# EAGLE design compass (EAGLE 8.7.0)
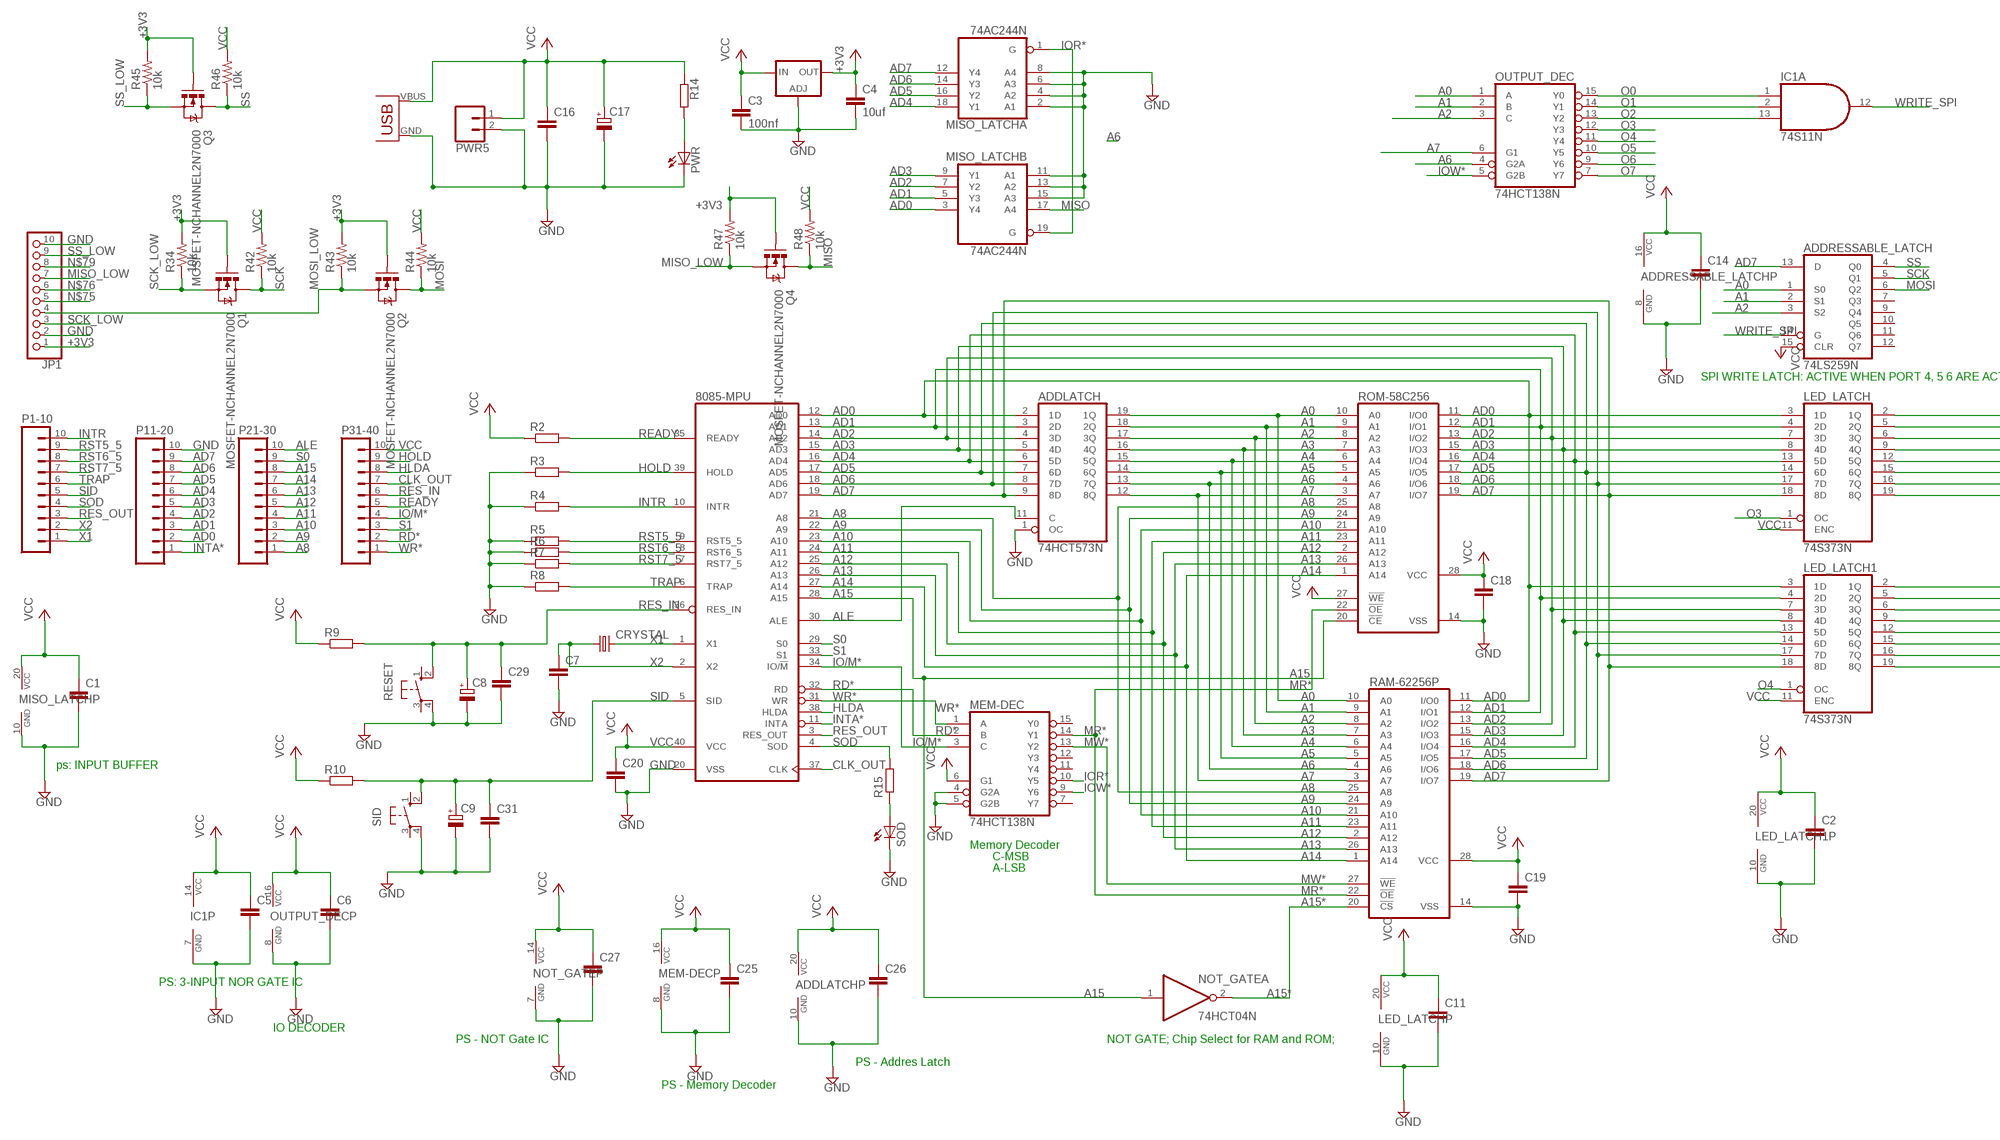
[diagram p0: schematic, sheet 1, part 1 of 2]
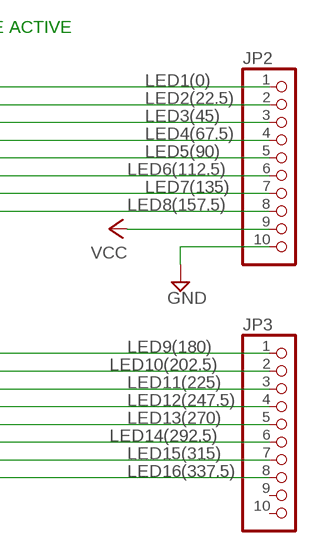
[diagram p1: schematic, sheet 1, part 2 of 2]

## Parts
8085-MPU  8085  [DIL40]
ADDLATCH  74HCT573N  [DIL20]
ADDRESSABLE_LATCH  74LS259N  [DIL16]
C1  C-EU025-025X050  [C025-025X050]
C2  C-EU025-025X050  [C025-025X050]
C3  100nf  C-EU025-025X050  [C025-025X050]
C4  10uf  C-EU025-025X050  [C025-025X050]
C5  C-EU025-025X050  [C025-025X050]
C6  C-EU025-025X050  [C025-025X050]
C7  C-EU025-025X050  [C025-025X050]
C8  CPOL-EUE2.5-6  [E2,5-6]
C9  CPOL-EUE2.5-6  [E2,5-6]
C11  C-EU025-025X050  [C025-025X050]
C14  C-EU025-025X050  [C025-025X050]
C16  C-EU025-025X050  [C025-025X050]
C17  CPOL-EUE2.5-6  [E2,5-6]
C18  C-EU025-025X050  [C025-025X050]
C19  C-EU025-025X050  [C025-025X050]
C20  C-EU025-025X050  [C025-025X050]
C25  C-EU025-025X050  [C025-025X050]
C26  C-EU025-025X050  [C025-025X050]
C27  C-EU025-025X050  [C025-025X050]
C29  C-EU025-025X050  [C025-025X050]
C31  C-EU025-025X050  [C025-025X050]
CRYSTAL  CRYSTALHC49US  [HC49US]
IC1  74S11N  [DIL14]
IC10  LD117AS33TR  [SOT223]
JP1  PINHD-1X10  [1X10]
JP2  PINHD-1X10  [1X10]
JP3  PINHD-1X10  [1X10]
LED_LATCH  74S373N  [DIL20]
LED_LATCH1  74S373N  [DIL20]
MEM-DEC  74HCT138N  [DIL16]
MISO_LATCH  74AC244N  [DIL20]
NOT_GATE  74HCT04N  [DIL14]
OUTPUT_DEC  74HCT138N  [DIL16]
P1-10  M10  [10P]
P11-20  M10  [10P]
P21-30  M10  [10P]
P31-40  M10  [10P]
PWR  LED5MM  [LED5MM]
PWR5  M02  [02P]
Q1  MOSFET-NCHANNEL2N7000  [TO-92]
Q2  MOSFET-NCHANNEL2N7000  [TO-92]
Q3  MOSFET-NCHANNEL2N7000  [TO-92]
Q4  MOSFET-NCHANNEL2N7000  [TO-92]
R2  R-EU_0204/7  [0204/7]
R3  R-EU_0204/7  [0204/7]
R4  R-EU_0204/7  [0204/7]
R5  R-EU_0204/7  [0204/7]
R6  R-EU_0204/7  [0204/7]
R7  R-EU_0204/7  [0204/7]
R8  R-EU_0204/7  [0204/7]
R9  R-EU_0204/7  [0204/7]
R10  R-EU_0204/7  [0204/7]
R14  R-EU_0204/7  [0204/7]
R15  R-EU_0204/7  [0204/7]
R34  10k  R-US_0204/7  [0204/7]
R42  10k  R-US_0204/7  [0204/7]
R43  10k  R-US_0204/7  [0204/7]
R44  10k  R-US_0204/7  [0204/7]
R45  10k  R-US_0204/7  [0204/7]
R46  10k  R-US_0204/7  [0204/7]
R47  10k  R-US_0204/7  [0204/7]
R48  10k  R-US_0204/7  [0204/7]
RAM-62256P  62256P  [DIL28-6]
RESET  10-XX  [B3F-10XX]
ROM-58C256  58C256P  [DIL28-6]
SID  10-XX  [B3F-10XX]
SOD  LED5MM  [LED5MM]
USB  USB(POWER)  [USB(POWER)]

## Nets
+3V3: C4.1 IC10.4(OUT) JP1.1 Q1.2(G) Q2.2(G) Q3.2(G) Q4.2(G) R34.2 R43.2 R45.2 R47.2
A0: ADDLATCH.19(1Q) ADDRESSABLE_LATCH.1(S0) OUTPUT_DEC.1(A) RAM-62256P.10(A0) ROM-58C256.10(A0)
A1: ADDLATCH.18(2Q) ADDRESSABLE_LATCH.2(S1) OUTPUT_DEC.2(B) RAM-62256P.9(A1) ROM-58C256.9(A1)
A2: ADDLATCH.17(3Q) ADDRESSABLE_LATCH.3(S2) OUTPUT_DEC.3(C) RAM-62256P.8(A2) ROM-58C256.8(A2)
A3: ADDLATCH.16(4Q) RAM-62256P.7(A3) ROM-58C256.7(A3)
A4: ADDLATCH.15(5Q) RAM-62256P.6(A4) ROM-58C256.6(A4)
A5: ADDLATCH.14(6Q) RAM-62256P.5(A5) ROM-58C256.5(A5)
A6: ADDLATCH.13(7Q) OUTPUT_DEC.4(G2A) RAM-62256P.4(A6) ROM-58C256.4(A6)
A7: ADDLATCH.12(8Q) OUTPUT_DEC.6(G1) RAM-62256P.3(A7) ROM-58C256.3(A7)
A8: 8085-MPU.21(A8) P21-30.1 RAM-62256P.25(A8) ROM-58C256.25(A8)
A9: 8085-MPU.22(A9) P21-30.2 RAM-62256P.24(A9) ROM-58C256.24(A9)
A10: 8085-MPU.23(A10) P21-30.3 RAM-62256P.21(A10) ROM-58C256.21(A10)
A11: 8085-MPU.24(A11) P21-30.4 RAM-62256P.23(A11) ROM-58C256.23(A11)
A12: 8085-MPU.25(A12) P21-30.5 RAM-62256P.2(A12) ROM-58C256.2(A12)
A13: 8085-MPU.26(A13) P21-30.6 RAM-62256P.26(A13) ROM-58C256.26(A13)
A14: 8085-MPU.27(A14) P21-30.7 RAM-62256P.1(A14) ROM-58C256.1(A14)
A15: 8085-MPU.28(A15) NOT_GATE.1(A:I) P21-30.8 ROM-58C256.20(!CE)
A15*: NOT_GATE.2(A:O) RAM-62256P.20(!CS)
AD0: 8085-MPU.12(AD0) ADDLATCH.2(1D) LED_LATCH1.3(1D) LED_LATCH.3(1D) MISO_LATCH.3(B:Y4) P11-20.2 RAM-62256P.11(I/O0) ROM-58C256.11(I/O0)
AD1: 8085-MPU.13(AD1) ADDLATCH.3(2D) LED_LATCH1.4(2D) LED_LATCH.4(2D) MISO_LATCH.5(B:Y3) P11-20.3 RAM-62256P.12(I/O1) ROM-58C256.12(I/O1)
AD2: 8085-MPU.14(AD2) ADDLATCH.4(3D) LED_LATCH1.7(3D) LED_LATCH.7(3D) MISO_LATCH.7(B:Y2) P11-20.4 RAM-62256P.13(I/O2) ROM-58C256.13(I/O2)
AD3: 8085-MPU.15(AD3) ADDLATCH.5(4D) LED_LATCH1.8(4D) LED_LATCH.8(4D) MISO_LATCH.9(B:Y1) P11-20.5 RAM-62256P.15(I/O3) ROM-58C256.15(I/O3)
AD4: 8085-MPU.16(AD4) ADDLATCH.6(5D) LED_LATCH1.13(5D) LED_LATCH.13(5D) MISO_LATCH.18(A:Y1) P11-20.6 RAM-62256P.16(I/O4) ROM-58C256.16(I/O4)
AD5: 8085-MPU.17(AD5) ADDLATCH.7(6D) LED_LATCH1.14(6D) LED_LATCH.14(6D) MISO_LATCH.16(A:Y2) P11-20.7 RAM-62256P.17(I/O5) ROM-58C256.17(I/O5)
AD6: 8085-MPU.18(AD6) ADDLATCH.8(7D) LED_LATCH1.17(7D) LED_LATCH.17(7D) MISO_LATCH.14(A:Y3) P11-20.8 RAM-62256P.18(I/O6) ROM-58C256.18(I/O6)
AD7: 8085-MPU.19(AD7) ADDLATCH.9(8D) ADDRESSABLE_LATCH.13(D) LED_LATCH1.18(8D) LED_LATCH.18(8D) MISO_LATCH.12(A:Y4) P11-20.9 RAM-62256P.19(I/O7) ROM-58C256.19(I/O7)
ALE: 8085-MPU.30(ALE) ADDLATCH.11(C) P21-30.10
CLK_OUT: 8085-MPU.37(CLK) P31-40.7
GND [power1]: 8085-MPU.20(VSS) ADDLATCH.1(OC) ADDLATCH.10(GND) ADDRESSABLE_LATCH.8(GND) C1.2 C2.2 C3.2 C4.2 C5.2 C6.2 C7.2 C8.- C9.- C11.2 C14.2 C16.2 C17.- C18.2 C19.2 C20.2 C25.2 C26.2 C27.2 C29.2 C31.2 IC1.7(P:GND) IC10.1(ADJ) JP1.2 JP1.10 JP2.10 LED_LATCH1.10(GND) LED_LATCH.10(GND) MEM-DEC.4(G2A) MEM-DEC.5(G2B) MEM-DEC.8(GND) MISO_LATCH.2(A:A1) MISO_LATCH.4(A:A2) MISO_LATCH.6(A:A3) MISO_LATCH.8(A:A4) MISO_LATCH.10(P:GND) MISO_LATCH.11(B:A1) MISO_LATCH.13(B:A2) MISO_LATCH.15(B:A3) NOT_GATE.7(P:GND) OUTPUT_DEC.8(GND) P11-20.10 PWR5.2 PWR.K(C) R3.1 R4.1 R5.1 R6.1 R7.1 R8.1 RAM-62256P.14(VSS) RESET.4(P1) ROM-58C256.14(VSS) SID.4(P1) SOD.K(C) USB.GND
HLDA: 8085-MPU.38(HLDA) P31-40.8
HOLD: 8085-MPU.39(HOLD) P31-40.9 R3.2
INTA*: 8085-MPU.11(INTA) P11-20.1
INTR: 8085-MPU.10(INTR) P1-10.10 R4.2
IO/M*: 8085-MPU.34(IO/!M) MEM-DEC.3(C) P31-40.4
IOR*: MEM-DEC.10(Y5) MISO_LATCH.1(A:G) MISO_LATCH.19(B:G)
IOW*: MEM-DEC.9(Y6) OUTPUT_DEC.5(G2B)
LED1(0): JP2.1 LED_LATCH.2(1Q)
LED2(22.5): JP2.2 LED_LATCH.5(2Q)
LED3(45): JP2.3 LED_LATCH.6(3Q)
LED4(67.5): JP2.4 LED_LATCH.9(4Q)
LED5(90): JP2.5 LED_LATCH.12(5Q)
LED6(112.5): JP2.6 LED_LATCH.15(6Q)
LED7(135): JP2.7 LED_LATCH.16(7Q)
LED8(157.5): JP2.8 LED_LATCH.19(8Q)
LED9(180): JP3.1 LED_LATCH1.2(1Q)
LED10(202.5): JP3.2 LED_LATCH1.5(2Q)
LED11(225): JP3.3 LED_LATCH1.6(3Q)
LED12(247.5): JP3.4 LED_LATCH1.9(4Q)
LED13(270): JP3.5 LED_LATCH1.12(5Q)
LED14(292.5): JP3.6 LED_LATCH1.15(6Q)
LED15(315): JP3.7 LED_LATCH1.16(7Q)
LED16(337.5): JP3.8 LED_LATCH1.19(8Q)
MISO: MISO_LATCH.17(B:A4) Q4.3(D) R48.1
MISO_LOW: JP1.7 Q4.1(S) R47.1
MOSI: ADDRESSABLE_LATCH.6(Q2) Q2.3(D) R44.1
MOSI_LOW: JP1.4 Q2.1(S) R43.1
MR*: MEM-DEC.14(Y1) RAM-62256P.22(!OE) ROM-58C256.22(!OE)
MW*: MEM-DEC.13(Y2) RAM-62256P.27(!WE)
N$25: R15.1 SOD.A
N$39: PWR.A R14.2
N$75: JP1.5
N$76: JP1.6
N$79: JP1.8
O0: IC1.1(A:I0) OUTPUT_DEC.15(Y0)
O1: IC1.2(A:I1) OUTPUT_DEC.14(Y1)
O2: IC1.13(A:I2) OUTPUT_DEC.13(Y2)
O3: LED_LATCH.1(OC) OUTPUT_DEC.12(Y3)
O4: LED_LATCH1.1(OC) OUTPUT_DEC.11(Y4)
O5: OUTPUT_DEC.10(Y5)
O6: OUTPUT_DEC.9(Y6)
O7: OUTPUT_DEC.7(Y7)
RD*: 8085-MPU.32(RD) MEM-DEC.2(B) P31-40.2
READY: 8085-MPU.35(READY) P31-40.5 R2.2
RES_IN: 8085-MPU.36(RES_IN) C8.+ C29.1 P31-40.6 R9.2 RESET.2(S1)
RES_OUT: 8085-MPU.3(RES_OUT) P1-10.3
RST5_5: 8085-MPU.9(RST5_5) P1-10.9 R5.2
RST6_5: 8085-MPU.8(RST6_5) P1-10.8 R6.2
RST7_5: 8085-MPU.7(RST7_5) P1-10.7 R7.2
S0: 8085-MPU.29(S0) P21-30.9
S1: 8085-MPU.33(S1) P31-40.3
SCK: ADDRESSABLE_LATCH.5(Q1) Q1.3(D) R42.1
SCK_LOW: JP1.3 Q1.1(S) R34.1
SID: 8085-MPU.5(SID) C9.+ C31.1 P1-10.5 R10.2 SID.2(S1)
SOD: 8085-MPU.4(SOD) P1-10.4 R15.2
SS: ADDRESSABLE_LATCH.4(Q0) Q3.3(D) R46.1
SS_LOW: JP1.9 Q3.1(S) R45.1
TRAP: 8085-MPU.6(TRAP) P1-10.6 R8.2
VCC [power1]: 8085-MPU.40(VCC) ADDLATCH.20(VCC) ADDRESSABLE_LATCH.15(CLR) ADDRESSABLE_LATCH.16(VCC) C1.1 C2.1 C3.1 C5.1 C6.1 C11.1 C14.1 C16.1 C17.+ C18.1 C19.1 C20.1 C25.1 C26.1 C27.1 IC1.14(P:VCC) IC10.3(IN) JP2.9 LED_LATCH1.11(ENC) LED_LATCH1.20(VCC) LED_LATCH.11(ENC) LED_LATCH.20(VCC) MEM-DEC.6(G1) MEM-DEC.16(VCC) MISO_LATCH.20(P:VCC) NOT_GATE.14(P:VCC) OUTPUT_DEC.16(VCC) P31-40.10 PWR5.1 R2.1 R9.1 R10.1 R14.1 R42.2 R44.2 R46.2 R48.2 RAM-62256P.28(VCC) ROM-58C256.27(!WE) ROM-58C256.28(VCC) USB.VBUS(VCC)
WR*: 8085-MPU.31(WR) MEM-DEC.1(A) P31-40.1
WRITE_SPI: ADDRESSABLE_LATCH.14(G) IC1.12(A:O)
X1: 8085-MPU.1(X1) CRYSTAL.2 P1-10.1
X2: 8085-MPU.2(X2) C7.1 CRYSTAL.1 P1-10.2
Unconnected: ADDRESSABLE_LATCH.7(Q3) ADDRESSABLE_LATCH.9(Q4) ADDRESSABLE_LATCH.10(Q5) ADDRESSABLE_LATCH.11(Q6) ADDRESSABLE_LATCH.12(Q7) IC1.3(B:I0) IC1.4(B:I1) IC1.5(B:I2) IC1.6(B:O) IC1.8(C:O) IC1.9(C:I0) IC1.10(C:I1) IC1.11(C:I2) JP3.9 JP3.10 MEM-DEC.7(Y7) MEM-DEC.11(Y4) MEM-DEC.12(Y3) MEM-DEC.15(Y0) NOT_GATE.3(B:I) NOT_GATE.4(B:O) NOT_GATE.5(C:I) NOT_GATE.6(C:O) NOT_GATE.8(D:O) NOT_GATE.9(D:I) NOT_GATE.10(E:O) NOT_GATE.11(E:I) NOT_GATE.12(F:O) NOT_GATE.13(F:I) RESET.1(S) RESET.3(P) SID.1(S) SID.3(P)

## Notes on the sheet
- SPI WRITE LATCH: ACTIVE WHEN PORT 4, 5 6 ARE ACTIVE
- ps: INPUT BUFFER
- Memory Decoder
- C-MSB
- A-LSB
- PS: 3-INPUT NOR GATE IC
- IO DECODER
- PS - NOT Gate IC | NOT GATE; Chip Select for RAM and ROM;
- PS - Addres Latch
- PS - Memory Decoder

## Library data of the parts
8085-MPU = micro-intel:8085: MICROCOMPUTER/PERIPHERAL DEVICE; OC_FARNELL: unknown; OC_NEWARK: unknown
ADDLATCH = 74xx-eu:74*573: 8-bit D latch BUS DRIVER
ADDRESSABLE_LATCH = 74xx-us:74*259: 8-bit addressable LATCH
C1-C6 C11 C14 C16 C18-C20 C25-C27 = resistor:C-EU: CAPACITOR, European symbol
C7 C29 C31 = rcl:C-EU: CAPACITOR, European symbol
C8 C9 C17 = rcl:CPOL-EU: POLARIZED CAPACITOR, European symbol
CRYSTAL = CEDT_JANUARY_2015_v5:CRYSTAL: Crystals Various standard crystals. Proven footprints. Spark Fun Electronics SKU : COM-00534
IC1 = 74xx-us:74*11: Triple 3-input AND gate
IC10 = v-reg:LD117A?*: Low drop fixed and adjustable positive voltage regulators 1 A Source: http://www.st.com/stonline/products/literature/ds/7194/ld1117axx.pdf
JP1-JP3 = pinhead:PINHD-1X10: PIN HEADER
LED_LATCH LED_LATCH1 = 74xx-us:74*373: Octal D type transparent LATCH, edge triggered
MEM-DEC OUTPUT_DEC = 74xx-eu:74*138: 3-line to 8-line DECODER/DEMULTIPLEXER
MISO_LATCH = 74xx-eu:74*244: Octal BUFFER and LINE DRIVER, 3-state
NOT_GATE = 74xx-eu:74*04: Hex INVERTER
P1-10 P11-20 P21-30 P31-40 = con-amp-quick:M10: AMP QUICK CONNECTOR; OC_FARNELL: unknown; OC_NEWARK: unknown
PWR SOD = CEDTv79:LED
PWR5 = CEDT_JANUARY_2015_v5:M02: AMP QUICK CONNECTOR
Q1-Q4 = SparkFun-DiscreteSemi:MOSFET-NCHANNEL: Common NMOSFET Parts MFG P/N Store ID Prod ID FDD8780 TRANS-09984 SI7820DN TRANS-11055 FDS6630A IC-08089 2N7002PW TRANS-11151 FQP30N06L COM-10213 TRANS-10060 BSS123LT1G TRANS-08345 BSS138 TRANS-00830 BS170 2N7000
R2-R8 R14 R15 = rcl:R-EU_: RESISTOR, European symbol
R9 R10 = resistor:R-EU_: RESISTOR, European symbol
R34 R42-R48 = rcl:R-US_: RESISTOR, American symbol
RAM-62256P = memory-hitachi:62256P: MEMORY; OC_FARNELL: unknown; OC_NEWARK: unknown
RESET SID = switch-omron:10-XX: OMRON SWITCH; MPN: B3F-1000; OC_FARNELL: 176432; OC_NEWARK: 36M3542
ROM-58C256 = memory-hitachi:58C256P: MEMORY; MPN: HN58C256AP85E; OC_FARNELL: 1496447; OC_NEWARK: 61M6616
USB = CEDT_JANUARY_2015_v5:USB(POWER)

## Net classes
0 default: width 0.356 mm, clearance 0.2 mm
1 power1: width 0.61 mm, clearance 0.2 mm
2 powermotor: width 0.762 mm, clearance 0.2 mm

## Board
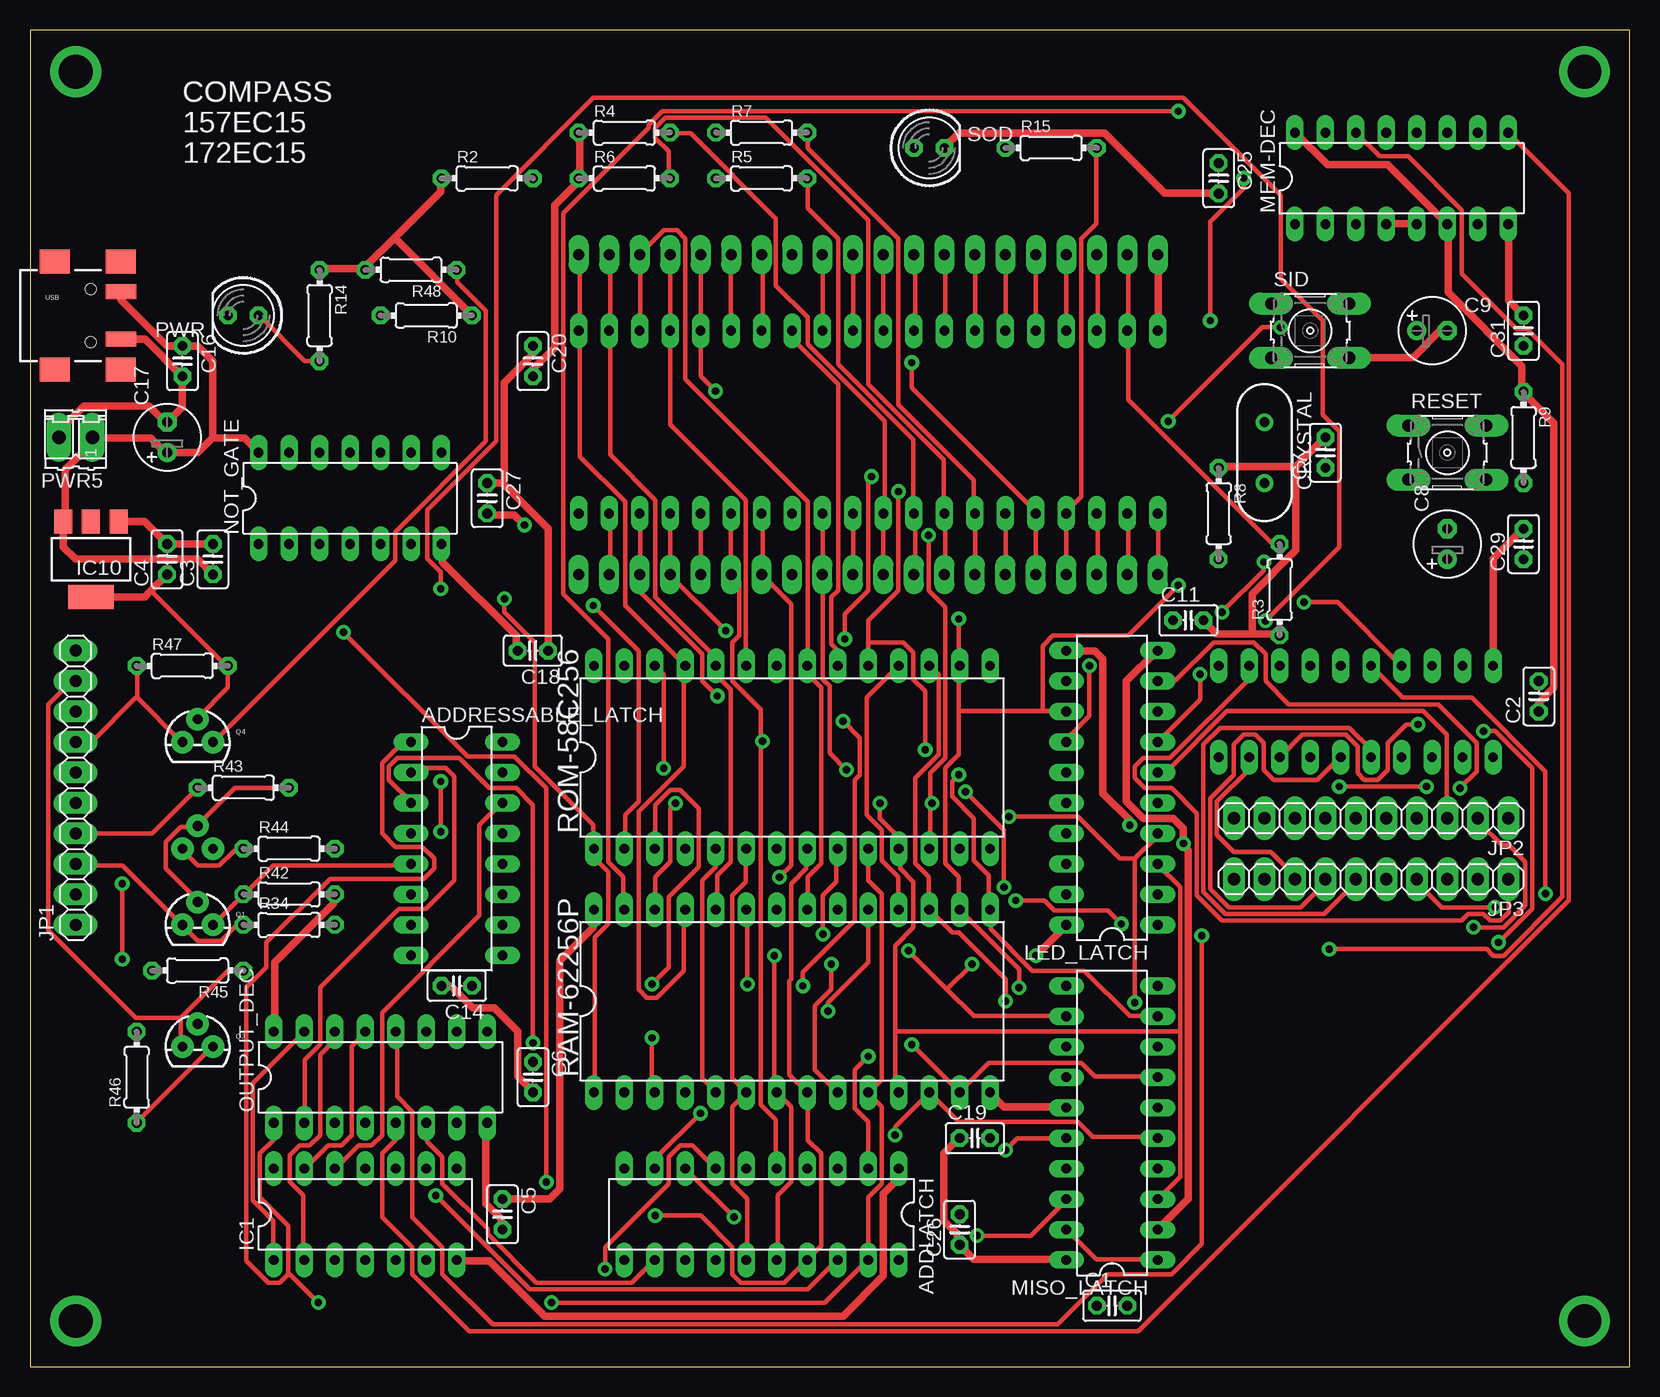
[diagram p2: board, top side]
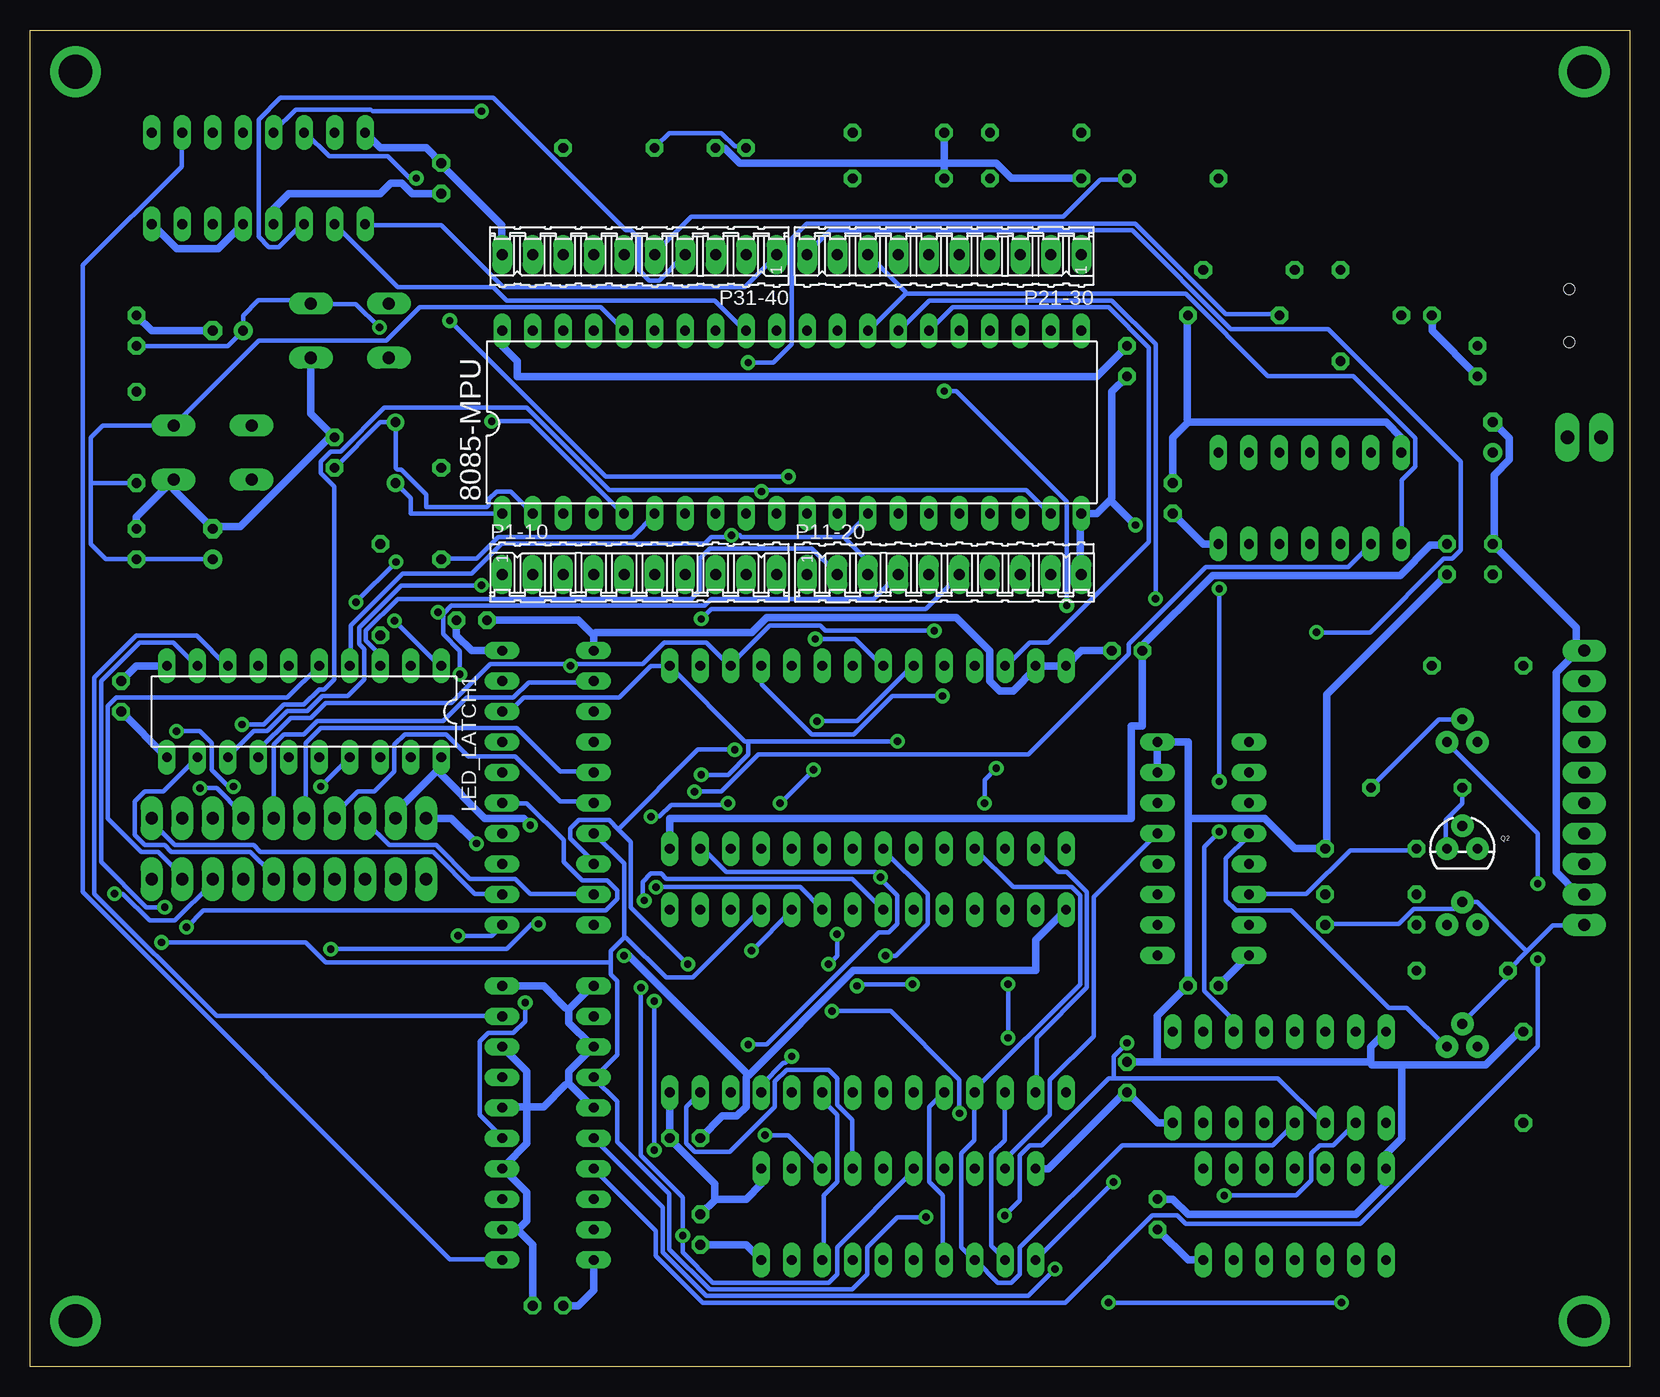
[diagram p3: board, bottom side, seen from below]

Size 133.33 x 111.43 mm. Coordinates in mm from the lower left corner, seen from the top.
Outline: 0,0 133.33,0 133.33,111.43 0,111.43 0,0
Copper layers (1*16): Top 0.035mm / dielectric 1.5mm / Bottom 0.035mm
Design rules "default *": minimum track width 10mil, minimum drill 24mil, track to track 8mil, track to pad 8mil, pad to pad 8mil, via to via 8mil, smd to smd 8mil, copper to edge 40mil, drill to drill 8mil, minimum pad ring 12mil, minimum via ring 12mil, stop-mask expansion 4mil, vias tented up to drill 0mil, thermal gap 10mil

### Footprints (pad centres in the part's own frame; a part is rotated, then mirrored left to right if it is on the bottom)
DIL40 = drill 0.813 long: 1 -24.13,-7.62; 2 -21.59,-7.62; 3 -19.05,-7.62; 4 -16.51,-7.62; 5 -13.97,-7.62; 6 -11.43,-7.62; 7 -8.89,-7.62; 8 -6.35,-7.62; 9 -3.81,-7.62; 10 -1.27,-7.62; 11 1.27,-7.62; 12 3.81,-7.62; 13 6.35,-7.62; 14 8.89,-7.62; 15 11.43,-7.62; 16 13.97,-7.62; 17 16.51,-7.62; 18 19.05,-7.62; 19 21.59,-7.62; 20 24.13,-7.62; 21 24.13,7.62; 22 21.59,7.62; 23 19.05,7.62; 24 16.51,7.62; 25 13.97,7.62; 26 11.43,7.62; 27 8.89,7.62; 28 6.35,7.62; 29 3.81,7.62; 30 1.27,7.62; 31 -1.27,7.62; 32 -3.81,7.62; 33 -6.35,7.62; 34 -8.89,7.62; 35 -11.43,7.62; 36 -13.97,7.62; 37 -16.51,7.62; 38 -19.05,7.62; 39 -21.59,7.62; 40 -24.13,7.62
DIL20 = drill 0.813 long: 1 -11.43,-3.81; 2 -8.89,-3.81; 3 -6.35,-3.81; 4 -3.81,-3.81; 5 -1.27,-3.81; 6 1.27,-3.81; 7 3.81,-3.81; 8 6.35,-3.81; 9 8.89,-3.81; 10 11.43,-3.81; 11 11.43,3.81; 12 8.89,3.81; 13 6.35,3.81; 14 3.81,3.81; 15 1.27,3.81; 16 -1.27,3.81; 17 -3.81,3.81; 18 -6.35,3.81; 19 -8.89,3.81; 20 -11.43,3.81
DIL16 = drill 0.813 long: 1 -8.89,-3.81; 2 -6.35,-3.81; 3 -3.81,-3.81; 4 -1.27,-3.81; 5 1.27,-3.81; 6 3.81,-3.81; 7 6.35,-3.81; 8 8.89,-3.81; 9 8.89,3.81; 10 6.35,3.81; 11 3.81,3.81; 12 1.27,3.81; 13 -1.27,3.81; 14 -3.81,3.81; 15 -6.35,3.81; 16 -8.89,3.81
C025-025X050 = drill 0.813 octagon: 1 -1.27,0; 2 1.27,0
E2,5-6 = drill 0.813 pad 1.6: + -1.27,0 | drill 0.813 pad 1.6 octagon: - 1.27,0
HC49US = drill 0.813: 1 -2.54,0; 2 2.54,0
DIL14 = drill 0.813 long: 1 -7.62,-3.81; 2 -5.08,-3.81; 3 -2.54,-3.81; 4 0,-3.81; 5 2.54,-3.81; 6 5.08,-3.81; 7 7.62,-3.81; 8 7.62,3.81; 9 5.08,3.81; 10 2.54,3.81; 11 0,3.81; 12 -2.54,3.81; 13 -5.08,3.81; 14 -7.62,3.81
SOT223 = smd 1.5 x 2: 1 -2.3,-3.15; 2 0,-3.15; 3 2.3,-3.15 | smd 3.8 x 2: 4 0,3.15
1X10 = drill 1.016 long: 1 -11.43,0; 2 -8.89,0; 3 -6.35,0; 4 -3.81,0; 5 -1.27,0; 6 1.27,0; 7 3.81,0; 8 6.35,0; 9 8.89,0; 10 11.43,0
10P = drill 0.914 long: 1 -11.43,0; 2 -8.89,0; 3 -6.35,0; 4 -3.81,0; 5 -1.27,0; 6 1.27,0; 7 3.81,0; 8 6.35,0; 9 8.89,0; 10 11.43,0
LED5MM = drill 0.813 octagon: A -1.27,0; K 1.27,0
02P = drill 1.143 long: 1 -1.397,0; 2 1.397,0
TO-92 = drill 0.813 pad 1.88: 1 -1.27,0; 2 0,1.905; 3 1.27,0
0204/7 = drill 0.813 octagon: 1 -3.81,0; 2 3.81,0
DIL28-6 = drill 0.813 long: 1 -16.51,-7.62; 2 -13.97,-7.62; 3 -11.43,-7.62; 4 -8.89,-7.62; 5 -6.35,-7.62; 6 -3.81,-7.62; 7 -1.27,-7.62; 8 1.27,-7.62; 9 3.81,-7.62; 10 6.35,-7.62; 11 8.89,-7.62; 12 11.43,-7.62; 13 13.97,-7.62; 14 16.51,-7.62; 15 16.51,7.62; 16 13.97,7.62; 17 11.43,7.62; 18 8.89,7.62; 19 6.35,7.62; 20 3.81,7.62; 21 1.27,7.62; 22 -1.27,7.62; 23 -3.81,7.62; 24 -6.35,7.62; 25 -8.89,7.62; 26 -11.43,7.62; 27 -13.97,7.62; 28 -16.51,7.62
B3F-10XX = drill 1.016 long: 1 -3.251,2.261; 2 3.251,2.261; 3 -3.251,-2.261; 4 3.251,-2.261
USB(POWER) = smd 2.54 x 1.27: GND 2.5,-1.981; VBUS 2.5,1.981 | smd 2.5 x 2: GND@1 -3,-4.5; GND@2 -3,4.5; GND@3 2.5,4.5; GND@4 2.5,-4.5 | hole 0.9: 0,2.2; 0,-2.2

### Placement (x,y rotation side)
8085-MPU  69.85,78.74 0 bottom
ADDLATCH  60.96,12.7 180 top
ADDRESSABLE_LATCH  35.56,43.18 270 top
C1  90.17,5.08 0 top
C2  125.73,55.88 90 top
C3  15.24,67.31 90 top
C4  11.43,67.31 90 top
C5  39.37,12.7 270 top
C6  41.91,24.13 270 top
C7  107.95,76.2 90 top
C8  118.11,68.58 90 top
C9  116.84,86.36 0 top
C11  96.52,62.23 0 top
C14  35.56,31.75 180 top
C16  12.7,83.82 270 top
C17  11.43,77.47 90 top
C18  41.91,59.69 180 top
C19  78.74,19.05 0 top
C20  41.91,83.82 270 top
C25  99.06,99.06 270 top
C26  77.47,11.43 90 top
C27  38.1,72.39 270 top
C29  124.46,68.58 90 top
C31  124.46,86.36 90 top
CRYSTAL  102.87,76.2 270 top
IC1  27.94,12.7 0 top
IC10  5.08,67.31 180 top
JP1  3.81,48.26 90 top
JP2  111.76,45.72 180 top
JP3  111.76,40.64 180 top
LED_LATCH  90.17,48.26 90 top
LED_LATCH1  110.49,54.61 180 bottom
MEM-DEC  114.3,99.06 0 top
MISO_LATCH  90.17,20.32 90 top
NOT_GATE  26.67,72.39 0 top
OUTPUT_DEC  29.21,24.13 0 top
P1-10  82.55,66.04 0 bottom
P11-20  57.15,66.04 0 bottom
P21-30  57.15,92.71 180 bottom
P31-40  82.55,92.71 180 bottom
PWR  17.78,87.63 180 top
PWR5  3.81,77.47 180 top
Q1  13.97,36.83 0 top
Q2  13.97,43.18 0 bottom
Q3  13.97,26.67 0 top
Q4  13.97,52.07 0 top
R2  38.1,99.06 0 top
R3  104.14,64.77 90 top
R4  49.53,102.87 0 top
R5  60.96,99.06 0 top
R6  49.53,99.06 0 top
R7  60.96,102.87 0 top
R8  99.06,71.12 270 top
R9  124.46,77.47 270 top
R10  33.02,87.63 180 top
R14  24.13,87.63 270 top
R15  85.09,101.6 0 top
R34  21.59,36.83 0 top
R42  21.59,39.37 0 top
R43  17.78,48.26 0 top
R44  21.59,43.18 0 top
R45  13.97,33.02 180 top
R46  8.89,24.13 90 top
R47  12.7,58.42 0 top
R48  31.75,91.44 180 top
RAM-62256P  63.5,30.48 0 top
RESET  118.11,76.2 0 top
ROM-58C256  63.5,50.8 0 top
SID  106.68,86.36 0 top
SOD  74.93,101.6 0 top
USB  5.08,87.63 0 top

### Tracks (layer width: path | path; a pad name or v marks a point on that pad's centre or on a via)
+3V3
  Top 0.356: Q4.2 13.97,54.09 16.48,56.6 16.48,58.42 R47.2 16.34,58.42 10.08,64.69 | R43.2 21.51,48.22 17.04,48.22 13.97,45.15 Q2.2 13.83,45.01 12.57,45.01 11.32,43.75 11.32,41.52 13.97,38.86 Q1.2
  Top 0.61: C4.1 10.08,64.69 9.55,64.16 IC10.4
  Bottom 0.356: Q3.2 13.97,28.66 10.2,32.44 10.2,32.99 R45.2 10.06,33.13 8.59,34.6 | 8.59,34.6 6.43,36.77 3.91,36.77 JP1.1 | R34.2 25.29,36.91 19.28,36.91 18.02,38.16 14.53,38.16 13.97,38.72 Q1.2 13.83,38.72 12.71,38.72 8.59,34.6 | Q4.2 13.97,53.95 15.93,53.95 21.51,48.36 R43.2
A0  (via drill 0.61)
  Top 0.356: ROM-58C256.10 69.85,40.54 70.97,39.42 70.97,23.91 69.99,22.94 RAM-62256P.10 69.85,22.8 70.97,21.68 70.97,15.25 69.85,14.14 ADDLATCH.19 69.71,8.83 66.22,5.33 v43.45,5.33 | 21.51,7.71 21.51,11.76 19.14,14.14 19.14,17.77 20.26,18.88 20.26,20.28 OUTPUT_DEC.1 | 21.51,7.71 20.82,7.01 19.84,7.01 18.02,8.83 18.02,31.6 19.7,33.27 19.7,35.37 25.01,40.68 32.83,40.68 33.67,41.52 33.67,42.35 32.69,43.33 30.45,43.33 29.34,44.45 29.34,50.32 31.01,51.99 31.71,51.99 ADDRESSABLE_LATCH.1 | v24.03,5.33 21.65,7.71 21.51,7.71
  Bottom 0.356: v24.03,5.33 v43.45,5.33
A1  (via drill 0.61)
  Top 0.356: v66.08,36.07 66.08,39.28 67.2,40.4 67.2,43.05 ROM-58C256.9 | v66.78,33.55 66.78,31.46 65.38,30.06 65.38,24.75 67.2,22.94 RAM-62256P.9 | OUTPUT_DEC.2 22.91,20.42 22.91,25.59 24.17,26.85 24.17,31.6 30.73,38.16 32.97,38.16 35.34,40.54 35.34,49.2 34.65,49.9 32.13,49.9 31.85,49.62 ADDRESSABLE_LATCH.2 | v33.81,14.27 41.63,6.45 64.82,6.45 67.2,8.83 ADDLATCH.18
  Bottom 0.356: ADDLATCH.18 67.2,8.97 67.2,14.27 66.08,15.39 66.08,20.98 67.2,22.1 67.2,22.8 RAM-62256P.9 | v66.08,36.07 66.08,34.25 v66.78,33.55 | v33.81,14.27 27.8,14.27 26.54,15.53 26.54,17.77 25.84,18.47 24.73,18.47 22.91,20.28 OUTPUT_DEC.2
A2  (via drill 0.61)
  Top 0.356: v52.11,12.6 55.88,12.6 58.53,9.94 58.53,7.71 59.23,7.01 62.87,7.01 64.68,8.83 ADDLATCH.17 64.82,8.97 65.94,10.08 65.94,17.77 64.82,18.88 64.82,22.8 RAM-62256P.8 64.68,22.94 63.28,24.33 63.28,32.16 63.42,32.3 63.42,40.26 64.68,41.52 64.68,43.05 ROM-58C256.8 | v41.91,26.99 41.91,46.82 40.51,48.22 38.28,48.22 35.76,50.74 30.59,50.74 29.9,50.04 29.9,48.92 31.71,47.1 ADDRESSABLE_LATCH.3
  Bottom 0.356: 43.03,24.05 43.45,24.05 49.03,18.47 50.01,18.47 50.85,17.63 50.85,13.86 v52.11,12.6 | 43.03,24.05 29.34,24.05 25.7,20.42 25.43,20.42 OUTPUT_DEC.3 | v41.91,26.99 43.03,25.87 43.03,24.05
A3  (via drill 0.61)
  Top 0.356: ADDLATCH.16 62.31,8.97 62.31,14.27 63.42,15.39 63.42,21.68 62.31,22.8 RAM-62256P.7 62.17,22.94 62.03,23.08 v62.03,34.25
  Bottom 0.356: v62.03,34.25 61.19,34.25 58.53,36.91 58.53,39.42 62.17,43.05 ROM-58C256.7
A4
  Top 0.356: ADDLATCH.15 59.79,8.97 59.79,14 58.53,15.25 58.53,21.68 59.65,22.8 RAM-62256P.6 59.65,22.94 58.53,24.05 58.53,39.28 59.65,40.4 59.65,43.05 ROM-58C256.6
A5
  Top 0.356: ROM-58C256.5 57.14,43.05 57.14,41.66 56.02,40.54 56.02,24.05 57.14,22.94 RAM-62256P.5
  Bottom 0.356: ADDLATCH.14 57.28,8.97 57.28,14.27 58.4,15.39 58.4,21.68 57.28,22.8 RAM-62256P.5
A6
  Bottom 0.356: OUTPUT_DEC.4 27.94,20.28 29.76,18.47 42.33,18.47 50.85,9.94 50.85,7.71 51.55,7.01 52.67,7.01 54.48,8.83 ADDLATCH.13 54.76,8.97 55.74,9.94 55.74,17.77 54.62,18.88 54.62,22.8 RAM-62256P.4 54.76,22.94 45.82,31.88 45.82,39.28 46.52,39.98 51.41,39.98 ROM-58C256.4
A7  (via drill 0.61)
  Top 0.356: OUTPUT_DEC.6 33.11,20.28 33.11,18.74 34.37,17.49 34.37,15.25 38.14,11.48 38.14,11.06 42.19,7.01 50.15,7.01 51.97,8.83 ADDLATCH.12 | v51.83,31.88 53.23,33.27 53.23,39.14 55.74,41.66 55.74,46.55 54.2,48.08 53.37,48.08 52.11,46.82 52.11,43.19 ROM-58C256.3 | v51.83,27.41 51.83,23.08 51.97,22.94 RAM-62256P.3
  Bottom 0.356: RAM-62256P.3 52.11,22.8 52.11,18.88 53.23,17.77 53.23,10.08 52.11,8.97 ADDLATCH.12 | v51.83,27.41 v51.83,31.88
A8
  Top 0.356: P21-30.1 45.82,92.65 45.82,86.36 8085-MPU.21 45.82,86.22 45.82,75.88 49.59,72.11 49.59,63.45 54.48,58.56 ROM-58C256.25 54.48,58.42 54.48,50.04 50.71,46.27 50.71,31.46 51.41,30.76 52.25,30.76 54.48,32.99 54.48,38.02 RAM-62256P.25
A9
  Top 0.356: P21-30.2 48.34,92.65 48.34,86.36 8085-MPU.22 48.34,86.22 48.34,76.02 52.11,72.25 52.11,64.15 57.14,59.12 57.14,58.56 ROM-58C256.24 57.28,58.42 57.28,57.58 58.4,56.46 58.4,42.07 57.28,40.96 57.28,38.16 RAM-62256P.24
A10
  Top 0.356: 8085-MPU.23 50.85,86.36 50.85,92.65 P21-30.3 50.85,92.79 52.81,94.74 53.92,94.74 54.62,94.04 54.62,82.31 64.82,72.11 64.82,58.56 ROM-58C256.21 64.82,58.42 64.82,57.72 65.94,56.6 65.94,41.94 64.82,40.82 64.82,38.16 RAM-62256P.21
A11  (via drill 0.61)
  Top 0.356: P21-30.4 53.37,92.65 53.37,86.36 8085-MPU.24 53.37,86.22 53.37,78.54 59.65,72.25 59.65,58.42 ROM-58C256.23 | v59.79,31.88 59.79,38.02 RAM-62256P.23 | v64.4,31.74 64.4,32.86 68.73,37.19 68.73,48.92 69.15,49.34 69.15,52.41 v67.75,53.81
  Bottom 0.356: v59.79,31.88 64.26,31.88 v64.4,31.74 | v67.75,53.81 64.4,53.81 59.79,58.42 ROM-58C256.23
A12  (via drill 0.61)
  Top 0.356: P21-30.5 8085-MPU.25 55.88,82.59 v57.14,81.33 | v46.94,63.45 50.71,59.68 50.71,47.1 49.59,45.99 49.59,43.19 ROM-58C256.2
  Bottom 0.356: RAM-62256P.2 49.45,22.94 49.45,27.41 45.26,31.6 45.26,39.56 46.94,41.24 47.64,41.24 49.45,43.05 ROM-58C256.2 | v57.14,81.33 56.16,81.33 46.94,72.11 v46.94,63.45
A13  (via drill 0.61)
  Top 0.356: 8085-MPU.26 58.4,86.36 58.4,92.65 P21-30.6 | v53.78,46.96 53.37,46.55 53.37,42.07 52.11,40.82 52.11,38.16 RAM-62256P.26 | v52.81,49.9 52.81,57.72 52.11,58.42 ROM-58C256.26
  Bottom 0.356: v53.78,46.96 53.78,48.92 v52.81,49.9 | 8085-MPU.26 58.4,86.36 56.44,88.32 43.45,88.32 40.09,84.96 40.09,68.76 48.48,60.38 50.01,60.38 51.97,58.42 ROM-58C256.26
A14  (via drill 0.61)
  Top 0.356: 8085-MPU.27 61.05,86.36 61.05,92.65 P21-30.7 | RAM-62256P.1 47.08,22.94 47.08,35.79 48.2,36.91 48.2,41.24 47.08,42.35 47.08,43.05 ROM-58C256.1 46.94,43.33 46.94,45.15 42.05,50.04 42.05,60.38 39.53,62.89 v39.53,64.01
  Bottom 0.356: v39.53,64.01 39.53,85.24 43.17,88.88 58.4,88.88 60.91,86.36 8085-MPU.27
A15
  Top 0.356: ROM-58C256.20 67.2,58.42 67.2,59.82 66.78,60.24 66.78,64.15 67.33,64.71 67.33,81.89 63.56,85.66 63.56,86.36 8085-MPU.28
  Bottom 0.356: 60.35,89.43 37.02,89.43 30.18,82.59 23.05,82.59 17.88,77.42 17.88,75.04 19,73.93 19,68.62 NOT_GATE.1 | 60.35,89.43 63.42,86.36 8085-MPU.28 | P21-30.8 63.42,92.65 60.35,89.57 60.35,89.43
A15*  (via drill 0.61)
  Top 0.356: v81.17,39.98 81.17,44.73 v77.95,47.94
  Bottom 0.356: v81.17,39.98 69.15,39.98 67.33,38.16 RAM-62256P.20 | v77.95,47.94 75.72,47.94 72.64,51.02 50.15,51.02 41.77,59.4 41.77,60.24 35.34,66.66 23.47,66.66 21.65,68.48 NOT_GATE.2
AD0  (via drill 0.61)
  Top 0.356: 8085-MPU.12 66.08,70.99 66.08,66.1 P11-20.2 66.08,65.96 66.08,57.3 66.64,56.74 66.64,51.16 v68.03,49.76 | 95.83,27.96 95.83,39.98 94.02,41.8 LED_LATCH.3 | 95.83,27.96 95.83,15.81 94.02,14 MISO_LATCH.3 | ADDLATCH.2 69.85,20.42 68.73,21.54 68.73,24.75 v69.85,25.87 | 72.08,27.96 72.08,23.22 72.36,22.94 RAM-62256P.11 | 72.08,27.96 72.08,35.09 73.62,36.63 73.62,40.4 72.5,41.52 72.5,43.05 ROM-58C256.11 72.36,43.33 72.36,44.17 70.83,45.71 v70.83,46.96 | 72.08,27.96 95.83,27.96
  Bottom 0.356: LED_LATCH1.3 104.22,58.42 104.22,59.4 105.33,60.52 105.33,61.35 102.68,64.01 78.23,64.01 77.53,64.71 77.53,67.36 76.69,68.2 68.17,68.2 66.08,66.1 P11-20.2 | v69.85,25.87 70.41,25.31 70.55,25.31 72.36,23.49 72.36,22.94 RAM-62256P.11 | v70.83,46.96 v68.03,49.76
AD1  (via drill 0.61)
  Top 0.356: v72.08,19.3 72.08,20 74.88,22.8 RAM-62256P.12 75.02,22.8 77.39,20.42 87.31,20.42 88.57,19.16 93.88,19.16 MISO_LATCH.5 | 92.06,42.35 93.88,44.17 93.88,44.45 LED_LATCH.4 | v92.06,30.34 92.06,42.35 | 75.02,46.96 75.02,49.48 76.28,50.74 76.28,63.31 74.88,64.71 v74.88,69.32 | 75.02,46.96 75.02,43.19 ROM-58C256.12 | 92.06,42.35 90.81,42.35 87.31,45.85 v81.58,45.85 | v75.16,46.96 75.02,46.96
  Bottom 0.356: v72.08,19.3 70.13,19.3 67.33,16.51 ADDLATCH.3 | v92.06,30.34 92.06,28.8 93.04,27.83 95.14,27.83 95.83,27.13 95.83,20.98 94.02,19.16 MISO_LATCH.5 | 65.38,69.18 74.04,69.18 74.18,69.32 v74.88,69.32 74.88,69.18 76.56,69.18 77.11,68.62 94.02,68.62 96.53,66.1 102.26,66.1 106.59,61.77 106.59,58.42 LED_LATCH1.4 | 65.38,69.18 63.56,70.99 8085-MPU.13 | P11-20.3 63.56,66.1 63.56,67.22 65.38,69.04 65.38,69.18 | v81.58,45.85 80.89,45.85 79.91,46.82 75.3,46.82 v75.16,46.96
AD2  (via drill 0.61)
  Top 0.356: MISO_LATCH.7 93.88,24.19 88.71,24.19 87.59,25.31 79.91,25.31 77.53,22.94 RAM-62256P.13 v73.48,26.85 | 8085-MPU.14 61.05,70.99 61.05,66.1 P11-20.4 61.05,65.96 63.42,63.59 63.42,41.8 v62.45,40.82 | v97.51,57.72 97.51,55.63 94.02,52.13 LED_LATCH.7 | v106.17,63.73 108.97,63.73 114.28,58.42 LED_LATCH1.7 | v102.82,67.08 102.82,66.38 v99.33,62.89
  Bottom 0.356: RAM-62256P.13 78.65,21.68 78.65,18.61 77.95,17.91 75.02,17.91 71.25,21.68 71.25,23.77 70.27,24.75 66.78,24.75 66.08,24.05 66.08,21.82 64.82,20.56 64.82,16.51 ADDLATCH.4 | ROM-58C256.13 77.39,43.05 77.11,43.05 75.3,41.24 62.87,41.24 v62.45,40.82 62.45,40.68 61.05,39.28 61.05,36.91 61.75,36.21 62.59,36.21 71.94,26.85 v73.48,26.85 | v97.51,57.72 97.51,59.68 98.91,61.07 98.91,62.61 | 98.91,62.61 98.91,62.75 98.21,63.45 77.11,63.45 76.56,64.01 63.01,64.01 61.05,65.96 P11-20.4 | v102.82,67.08 v106.17,63.73 | v99.33,62.89 99.05,62.61 98.91,62.61
AD3  (via drill 0.61)
  Top 0.356: MISO_LATCH.9 93.88,29.22 91.64,29.22 87.87,32.99 83.54,32.99 80.05,36.49 80.05,38.02 RAM-62256P.15 79.91,38.16 79.91,40.96 78.65,42.21 78.65,45.71 76.83,47.52 76.83,48.78 v77.39,49.34 | 60.91,52.13 60.91,54.79 58.53,57.16 58.53,60.38 59.09,60.94 59.09,65.41 58.53,65.96 P11-20.5 58.4,66.1 58.4,70.99 8085-MPU.15 | 60.91,52.13 60.91,21.82 62.17,20.56 62.17,16.51 ADDLATCH.5 | v61.05,52.13 60.91,52.13
  Bottom 0.356: LED_LATCH1.8 116.93,58.42 119.44,60.94 124.47,60.94 127.97,57.44 127.97,39.42 117.77,29.22 94.02,29.22 MISO_LATCH.9 | LED_LATCH.8 93.88,54.65 93.32,54.65 92.2,55.77 84.24,55.77 81.58,58.42 ROM-58C256.15 79.91,58.28 73.76,52.13 73.48,52.13 | v61.05,52.13 73.48,52.13 | v77.39,49.34 75.16,49.34 73.48,51.02 73.48,52.13
AD4  (via drill 0.61)
  Top 0.356: v78.93,10.92 83.4,10.92 86.33,13.86 MISO_LATCH.18 | P11-20.6 8085-MPU.16 | 77.39,54.65 77.39,58.42 ROM-58C256.16 77.39,58.56 v77.39,62.33 | 77.39,54.65 77.39,51.02 76.28,49.9 76.28,41.94 77.39,40.82 77.39,38.16 RAM-62256P.16 77.53,38.02 82.42,33.13 v82.42,31.6 | 77.39,54.65 84.38,54.65 | 84.38,54.65 86.33,54.65 LED_LATCH.13 | v95.69,65.13 91.5,60.94 85.22,60.94 84.38,60.1 84.38,54.65
  Bottom 0.356: ADDLATCH.6 59.79,16.51 59.79,16.23 66.08,9.94 66.08,7.71 66.78,7.01 76.42,7.01 78.93,9.53 v78.93,10.92 78.93,14.14 82.42,17.63 v82.42,31.6 | v95.69,65.13 102.4,65.13 105.89,61.63 105.89,60.24 105.47,59.82 105.47,57.3 106.87,55.91 108.97,55.91 110.22,54.65 111.9,54.65 113.58,52.97 114.69,52.97 116.79,50.88 LED_LATCH1.13 | v77.39,62.33 76.56,63.17 58.67,63.17 55.88,65.96 P11-20.6
AD5  (via drill 0.61)
  Top 0.356: v47.92,8.13 47.92,9.94 53.23,15.25 53.23,17.49 54.2,18.47 55.18,18.47 57.14,16.51 ADDLATCH.7 | 8085-MPU.17 53.37,70.99 53.37,66.1 P11-20.7 53.37,65.96 v57.98,61.35 | ROM-58C256.17 75.02,58.42 75.72,57.72 75.72,51.02 73.76,49.06 73.76,41.94 74.88,40.82 74.88,38.16 RAM-62256P.17 75.02,38.02 76.83,36.21 77.39,36.21 81.31,32.3 v81.31,30.48 | v88.29,58.42 88.29,54.23 86.47,52.41 86.47,52.13 LED_LATCH.14 | v81.31,18.05 82.28,19.02 86.33,19.02 MISO_LATCH.16
  Bottom 0.356: v47.92,8.13 50.15,5.89 76.97,5.89 80.61,9.53 80.61,13.3 MISO_LATCH.16 | 88.29,58.56 82.28,58.56 80.47,60.38 76.97,60.38 75.02,58.42 ROM-58C256.17 74.88,58.56 71.67,61.77 67.47,61.77 67.06,61.35 v57.98,61.35 | 88.29,58.56 95,58.56 98.21,55.35 108.69,55.35 109.94,54.09 111.62,54.09 114.28,51.44 114.28,50.88 LED_LATCH1.14 | v88.29,58.42 88.29,58.56 | v81.31,30.48 v81.31,18.05
AD6  (via drill 0.61)
  Top 0.356: 8085-MPU.18 50.85,70.99 50.85,66.1 P11-20.8 50.85,65.96 50.85,64.57 56.02,59.4 56.02,57.16 v57.28,55.91 | RAM-62256P.18 72.36,38.16 72.36,40.82 70.97,42.21 70.97,44.73 69.71,45.99 69.71,55.77 72.36,58.42 ROM-58C256.18 | v58.67,12.46 54.62,16.51 ADDLATCH.8 | v116.37,48.36 v109.11,48.36 | v121.12,52.97 122.1,52.97 125.17,49.9 125.17,38.16 v122.38,35.37
  Bottom 0.356: v57.28,55.91 61.47,55.91 64.68,52.69 68.17,52.69 72.36,56.88 72.36,58.42 ROM-58C256.18 | v58.67,12.46 61.05,12.46 63.56,9.94 63.56,7.71 64.82,6.45 76.69,6.45 80.05,9.8 80.05,14.41 84.38,18.74 84.38,22.1 86.33,24.05 MISO_LATCH.14 86.19,24.19 84.38,26.01 84.38,32.16 84.94,32.72 84.94,33.69 | 83.82,35.79 83.82,41.94 86.33,44.45 LED_LATCH.17 | 83.82,35.79 84.94,34.67 84.94,33.69 | v109.11,48.36 106.73,50.74 LED_LATCH1.17 | v116.37,48.36 116.79,48.36 118.19,49.76 118.19,51.99 119.16,52.97 v121.12,52.97 | v122.38,35.37 110.36,35.37 108.69,33.69 84.94,33.69 | RAM-62256P.18 72.5,38.02 78.09,32.44 80.33,32.44 83.68,35.79 83.82,35.79
AD7  (via drill 0.61)
  Top 0.356: v73.2,34.67 76.42,31.46 | 76.42,31.46 78.65,29.22 86.33,29.22 MISO_LATCH.12 | 76.42,31.46 v78.51,33.55 | 8085-MPU.19 48.34,70.99 48.34,66.1 P11-20.9 | LED_LATCH1.18 106.03,52.69 109.67,52.69 110.64,51.71 110.64,49.48 111.2,48.92 112.32,48.92 113.16,49.76 113.16,51.99 114.69,53.53 v115.67,53.53 | 69.85,60.38 69.85,62.19 72.36,64.71 v72.36,72.95 | 69.85,60.38 ROM-58C256.19 | v74.6,51.44 74.6,56.32 73.62,57.3 73.62,59.54 72.78,60.38 69.85,60.38 | v55.88,21.12 52.11,17.35 52.11,16.51 ADDLATCH.9 | v66.5,29.64 66.5,30.34 69.85,33.69 RAM-62256P.19
  Bottom 0.356: ADDRESSABLE_LATCH.13 39.4,44.45 44.7,39.14 44.7,27.55 48.34,23.91 48.34,20.98 51.97,17.35 51.97,16.51 ADDLATCH.9 | v73.2,34.67 69.85,38.02 RAM-62256P.19 | 84.31,44.8 83.26,43.75 83.26,38.3 v78.51,33.55 | 84.31,44.8 85.08,45.57 87.59,45.57 88.29,44.87 88.29,44.03 86.47,42.21 86.47,41.94 LED_LATCH.18 | v115.67,53.53 113.86,53.53 112.18,55.21 110.5,55.21 109.25,56.46 108.83,56.46 107.99,57.3 107.99,73.37 109.11,74.48 109.11,75.46 108.27,76.3 107.43,76.3 103.8,79.93 91.92,79.93 85.08,73.09 72.36,73.09 | 72.36,73.09 50.29,73.09 48.34,71.13 8085-MPU.19 | v72.36,72.95 72.36,73.09 | 84.31,44.8 77.67,51.44 v74.6,51.44 | v55.88,21.12 55.88,23.91 61.61,29.64 v66.5,29.64
ALE  (via drill 0.61)
  Top 0.356: v43.03,15.39 43.03,48.22 40.37,50.88 36.46,50.88 v26.12,61.21 | 8085-MPU.30 68.59,86.36 68.59,92.65 P21-30.10
  Bottom 0.356: v43.03,15.39 ADDLATCH.11 | v26.12,61.21 21.65,61.21 15.51,67.36 14.81,67.36 14.11,68.06 14.11,75.46 25.15,86.5 33.25,86.5 41.49,94.74 66.64,94.74 68.59,92.79 P21-30.10
CLK_OUT
  Top 0.356: 8085-MPU.37 86.33,86.36 86.33,92.65 P31-40.7
GND  (via drill 0.61)
  Top 0.61: USB.GND 9.6,85.65 C16.2 12.7,80.01 C17.- 11.18,78.82 9.92,80.07 4.47,80.07 2.52,78.12 2.52,77.56 PWR5.2 | IC10.1 9.55,70.46 C4.2 C3.2 | C14.2 34.37,31.74 35.06,31.74 36.88,29.92 38.7,29.92 40.65,27.96 40.65,24.19 41.91,22.94 C6.2 | C5.2 39.26,11.48 39.26,12.32 38,13.58 38,20.28 OUTPUT_DEC.8 | MISO_LATCH.15 86.33,21.68 81.17,21.68 80.05,22.8 RAM-62256P.14 | IC1.7 35.62,8.83 38.28,8.83 42.89,4.22 67.75,4.22 71.11,7.57 71.11,14.41 72.36,15.67 72.36,16.51 ADDLATCH.1 | 101.84,61.07 98.91,61.07 97.79,62.19 C11.2 | 101.84,61.07 104.08,61.07 R3.1 | LED_LATCH.10 93.88,59.68 91.36,57.16 91.36,47.1 92.76,45.71 95.28,45.71 96.11,44.87 v96.11,43.61 96.25,43.33 96.53,43.05 96.53,14 94.02,11.48 MISO_LATCH.2 | MEM-DEC.5 115.53,95.3 113.16,95.3 MEM-DEC.4 | C31.2 123.22,88.88 123.22,95.16 MEM-DEC.8 | LED_LATCH1.10 121.96,58.42 121.96,67.36 124.33,69.74 C29.2 | 105.47,75.04 99.19,75.04 R8.1 | 105.47,75.04 107.85,77.42 C7.2 | C9.- 117.49,86.36 115.25,84.12 109.94,84.12 SID.4 | 101.84,61.07 101.84,64.43 105.47,68.06 105.47,75.04 | NOT_GATE.7 34.37,68.48 34.37,67.08 40.51,60.94 40.51,59.82 C18.2 | R4.1 45.82,102.85 45.82,99.07 R6.1 45.68,98.79 43.73,96.84 43.73,84.96 41.91,83.15 C20.2 | v41.21,70.16 40.37,70.99 38.14,70.99 C27.2 | C25.2 99.05,97.82 94.58,97.82 89.55,102.85 77.39,102.85 76.28,101.73 SOD.K
  Bottom 0.61: RAM-62256P.14 C19.2 79.91,18.88 76.28,15.25 76.28,14.14 76.2,13.97 | OUTPUT_DEC.8 39.37,20.32 C6.2 42.19,22.8 48.48,16.51 ADDLATCH.10 | C14.2 ADDRESSABLE_LATCH.8 | C5.2 36.83,8.89 IC1.7 | C27.2 35.56,68.58 NOT_GATE.7 | C20.2 43.18,81.28 43.18,72.39 43.31,72.26 | 43.31,72.26 44.45,71.12 8085-MPU.20 45.82,70.85 45.82,66.1 P11-20.10 | C2.2 124.46,58.42 LED_LATCH1.10 | C11.2 97.79,60.96 96.52,59.69 LED_LATCH.10 | SID.4 109.93,79.45 C7.2 108.27,77.56 115.81,70.02 118.05,70.02 C8.- 121.36,73.1 RESET.4 124.46,70.84 C29.2 | C9.- 123.19,86.36 C31.2 | C26.2 76.2,13.97 | 76.2,13.97 73.66,13.97 72.39,15.24 ADDLATCH.1 | ROM-58C256.14 80.01,45.72 41.54,45.72 41.54,53.41 40.64,53.41 C18.2 40.79,59.96 34.78,65.96 19.14,65.96 16.62,68.48 15.37,68.48 C3.2 | C1.2 91.44,10.16 92.69,11.41 | 92.69,11.41 92.71,11.43 MISO_LATCH.2 | 92.69,11.41 91.92,12.18 91.92,14.55 93.88,16.51 MISO_LATCH.4 93.74,16.79 91.92,18.61 91.92,21.68 | 88.43,23.63 88.43,24.61 86.47,26.57 MISO_LATCH.13 86.61,26.85 88.43,28.66 88.43,29.78 | 88.43,23.63 86.47,21.68 MISO_LATCH.15 | 91.92,21.68 90.53,21.68 88.71,23.49 88.43,23.63 | 91.92,21.68 93.88,21.68 MISO_LATCH.6 | MISO_LATCH.8 91.92,24.61 91.92,21.68 | 88.43,29.78 86.47,31.74 MISO_LATCH.11 | MISO_LATCH.10 93.88,31.74 90.53,31.74 88.71,29.92 88.43,29.78 | v96.11,43.61 98.21,45.71 100.31,45.71 JP2.10 | MEM-DEC.5 115.67,95.16 117.63,93.21 121.12,93.21 123.08,95.16 MEM-DEC.8 | JP1.2 3.91,39.42 4.33,39.42 6.15,41.24 6.15,57.86 4.33,59.68 3.91,59.68 JP1.10 4.47,59.96 4.47,61.63 11.18,68.34 C4.2 11.32,68.62 11.32,74.35 10.06,75.6 10.06,77.42 11.32,78.68 C17.-
  Bottom 0.61: PWR.K 16.48,87.62 16.48,86.36 12.71,82.59 C16.2 | 57.14,100.33 57.14,102.85 R7.1 | 57.14,100.33 57.14,99.07 R5.1 | 57.14,100.33 74.18,100.33 75.44,101.59 76.14,101.59 SOD.K | 57.14,100.33 52.81,100.33 51.55,99.07 45.82,99.07 R6.1 | 43.31,72.26 v41.21,70.16 | C25.2 101.49,97.79 102.36,98.65 103.28,98.65 104.15,97.79 111.76,97.79 113.03,96.52 MEM-DEC.4
HLDA
  Top 0.356: 8085-MPU.38 88.99,86.36 88.99,92.65 P31-40.8
HOLD
  Top 0.356: P31-40.9 91.5,92.65 91.5,86.36 8085-MPU.39 91.5,86.22 91.5,80.63 103.52,68.62 104.08,68.62 R3.2
INTA*
  Top 0.356: 8085-MPU.11 68.59,70.99 68.59,66.1 P11-20.1
INTR
  Top 0.356: P1-10.10 71.11,66.1 71.11,70.99 8085-MPU.10 71.25,71.13 71.25,78.82 64.82,85.24 64.82,87.48 62.17,90.13 62.17,95.72 55.04,102.85 53.37,102.85 R4.2
IO/M*
  Top 0.356: 8085-MPU.34 78.79,86.36 78.79,92.65 P31-40.4
  Bottom 0.356: MEM-DEC.3 110.5,95.16 110.78,95.16 112.6,93.35 113.44,93.35 114.28,94.18 114.28,103.96 112.46,105.78 94.72,105.78 83.68,94.74 83.26,94.74 82.56,94.04 82.56,91.39 81.72,90.55 80.89,90.55 78.79,92.65 P31-40.4
IOR*
  Top 0.356: MISO_LATCH.1 93.88,8.97 88.85,8.97 86.47,11.34 MISO_LATCH.19
  Bottom 0.356: MEM-DEC.10 120.7,102.85 120.7,100.05 128.94,91.81 128.94,39.56 98.35,8.97 94.02,8.97 MISO_LATCH.1
IOW*
  Top 0.356: MEM-DEC.9 128.25,97.82 128.25,38.86 92.34,2.96 36.6,2.96 31.85,7.71 31.85,9.94 29.34,12.46 29.34,17.77 30.45,18.88 30.45,20.28 OUTPUT_DEC.5
LED1(0)
  Bottom 0.356: LED_LATCH.2 94.02,39.42 96.25,39.42 99.75,42.91 114.14,42.91 114.69,43.47 121.26,43.47 123.08,45.29 123.08,45.71 JP2.1
LED2(22.5)  (via drill 0.61)
  Top 0.356: v120.28,36.63 122.8,36.63 124.61,38.44 124.61,42.07 123.22,43.47 122.66,43.47 120.7,45.43 120.7,45.71 JP2.2
  Bottom 0.356: v120.28,36.63 118.89,38.02 85.36,38.02 84.38,39 84.38,39.7 85.22,40.54 87.31,40.54 88.85,42.07 88.85,43.89 91.92,46.96 93.88,46.96 LED_LATCH.5
LED3(45)
  Top 0.356: LED_LATCH.6 94.02,49.62 94.72,49.62 99.75,54.65 116.09,54.65 118.05,52.69 118.05,45.85 JP2.3
LED4(67.5)  (via drill 0.61)
  Top 0.356: v119.16,48.22 120.56,49.62 120.56,51.99 117.35,55.21 104.92,55.21 102.96,57.16 102.96,59.4 101.98,60.38 98.63,60.38 95.42,57.16 94.02,57.16 LED_LATCH.9
  Bottom 0.356: v119.16,48.22 117.77,48.22 115.67,46.13 115.67,45.85 JP2.4
LED5(90)
  Bottom 0.356: LED_LATCH.12 86.47,57.02 91.78,57.02 93.04,55.77 96.95,55.77 98.91,53.81 109.39,53.81 110.5,52.69 112.18,52.69 113.02,51.85 113.02,45.85 JP2.5
LED6(112.5)
  Bottom 0.356: LED_LATCH.15 86.47,49.62 89.13,49.62 92.76,53.25 109.11,53.25 110.36,51.99 110.36,45.85 JP2.6
LED7(135)
  Bottom 0.356: LED_LATCH.16 86.47,47.1 89.13,47.1 92.9,50.88 96.81,50.88 98.63,52.69 102.12,52.69 102.96,51.85 102.96,49.62 104.64,47.94 106.03,47.94 107.85,46.13 107.85,45.85 JP2.7
LED8(157.5)
  Bottom 0.356: LED_LATCH.19 86.47,39.42 91.64,39.42 92.9,40.68 96.67,40.68 99.47,43.47 103.38,43.47 105.33,45.43 105.33,45.71 JP2.8
LED9(180)
  Top 0.356: LED_LATCH1.2 101.56,58.42 101.56,57.3 95,50.74 92.76,50.74 92.06,50.04 92.06,49.06 92.9,48.22 95.14,48.22 97.23,46.13 97.23,39.28 99.33,37.19 119.3,37.19 119.86,37.74 121.12,37.74 121.68,37.19 122.52,37.19 123.22,37.88 123.22,40.54 JP3.1
LED10(202.5)
  Bottom 0.356: LED_LATCH1.5 109.25,58.42 111.9,55.77 126.15,55.77 126.85,55.07 126.85,45.71 124.05,42.91 122.66,42.91 120.7,40.96 120.7,40.68 JP3.2
LED11(225)  (via drill 0.61)
  Top 0.356: LED_LATCH1.6 114.41,55.77 120.14,55.77 126.29,49.62 v126.29,39.42
  Bottom 0.356: v126.29,39.42 125.59,39.42 123.36,37.19 121.26,37.19 118.19,40.26 118.19,40.54 JP3.3
LED12(247.5)  (via drill 0.61)
  Top 0.356: v122.1,38.3 117.63,38.3 115.67,40.26 115.67,40.54 JP3.4
  Bottom 0.356: v122.1,38.3 123.64,38.3 127.41,42.07 127.41,57.16 124.19,60.38 121.4,60.38 119.44,58.42 LED_LATCH1.9
LED13(270)
  Bottom 0.356: LED_LATCH1.12 122.24,47.94 123.77,47.94 124.61,47.1 124.61,44.31 123.77,43.47 122.1,43.47 121.54,42.91 114.97,42.91 113.16,41.1 113.16,40.68 JP3.5
LED14(292.5)
  Top 0.356: LED_LATCH1.15 111.76,51.44 109.94,53.25 99.19,53.25 97.79,51.85 97.79,39.56 99.61,37.74 107.85,37.74 110.36,40.26 110.36,40.54 JP3.6
LED15(315)
  Top 0.356: LED_LATCH1.16 109.11,50.74 107.29,48.92 103.66,48.92 102.82,49.76 102.82,51.99 102.12,52.69 101.14,52.69 100.31,51.85 100.31,49.34 98.35,47.38 98.35,39.84 99.89,38.3 105.89,38.3 107.85,40.26 107.85,40.54 JP3.7
LED16(337.5)
  Top 0.356: LED_LATCH1.19 101.56,50.74 101.56,49.76 98.91,47.1 98.91,44.31 100.31,42.91 103.38,42.91 105.33,40.96 105.33,40.68 JP3.8
MISO  (via drill 0.61)
  Top 0.356: v7.68,40.26 v7.68,33.97 | R48.1 35.62,91.39 35.62,90.41 38,88.04 38,77.14 30.45,69.6 30.45,67.22 15.37,52.13 Q4.3
  Bottom 0.356: v7.68,33.97 7.68,26.71 22.49,11.9 37.02,11.9 37.72,12.6 39.81,12.6 47.08,5.33 77.25,5.33 81.17,9.25 81.17,11.34 86.33,16.51 MISO_LATCH.17 | v7.68,40.26 7.68,44.45 15.23,51.99 Q4.3
MISO_LOW
  Top 0.356: 8.94,55.77 8.94,58.42 R47.1 | 8.94,55.77 12.57,52.13 Q4.1 | JP1.7 3.91,52.13 5.17,52.13 8.8,55.77 8.94,55.77
MOSI
  Top 0.356: R44.1 17.74,43.05 17.04,43.05 15.79,41.8 13.97,41.8 12.71,43.05 Q2.3
  Bottom 0.356: ADDRESSABLE_LATCH.6 31.71,39.42 26.96,39.42 23.33,43.05 17.88,43.05 R44.1
MOSI_LOW
  Top 0.356: JP1.4 10.2,44.45 13.97,48.22 R43.1
  Bottom 0.356: R43.1 13.97,46.96 15.37,45.57 15.37,43.19 Q2.1
MR*  (via drill 0.61)
  Top 0.356: v82.14,38.86 84.52,38.86 85.36,38.02 89.83,38.02 v90.94,36.91 | v108.27,34.81 121.4,34.81 121.96,34.25 122.8,34.25 127.69,39.14 127.69,83.57 124.75,86.5 123.91,86.5 119.3,91.11 119.3,96.42 114.83,100.89 112.46,100.89 110.5,102.85 MEM-DEC.14 | v67.89,60.66 67.89,62.75 69.85,64.71 69.85,73.93 v70.13,74.21 | v98.35,87.2 98.35,95.44 101.14,98.23 v101.14,99.07
  Bottom 0.356: v82.14,38.86 82.28,39 82.28,40.4 81.58,41.1 80.75,41.1 80.33,40.68 64.82,40.68 62.31,38.16 RAM-62256P.22 | v90.94,36.91 91.5,36.91 93.6,34.81 v108.27,34.81 | v67.89,60.66 64.54,60.66 62.31,58.42 ROM-58C256.22 | v70.13,74.21 85.36,74.21 v98.35,87.2 | v101.14,99.07 101.7,99.07 103.52,100.89 108.41,100.89 110.36,102.85 MEM-DEC.14
MW*  (via drill 0.61)
  Top 0.356: v95.69,104.66 52.67,104.66 51.55,103.54 51.55,103.26 44.42,96.14 44.42,64.43 48.2,60.66 48.2,42.07 49.45,40.82 49.45,38.16 RAM-62256P.27
  Bottom 0.356: v95.69,104.66 104.78,104.66 104.92,104.8 111.2,104.8 113.02,102.98 MEM-DEC.13
N$2  (via drill 2.8 pad 4.21)
  other vias: 3.81,107.95
N$3  (via drill 2.8 pad 4.21)
  other vias: 129.54,107.95
N$4  (via drill 2.8 pad 4.21)
  other vias: 129.54,3.81
N$5  (via drill 2.8 pad 4.21)
  other vias: 3.81,3.81
N$25
  Bottom 0.356: SOD.A 73.76,101.73 74.6,101.73 75.72,102.85 80.05,102.85 81.17,101.73 R15.1
N$39
  Top 0.356: R14.2 24.03,83.85 22.91,83.85 19.14,87.62 PWR.A
O0
  Top 0.356: IC1.1 20.26,8.97 20.26,12.18 18.58,13.86 18.58,23.63 22.77,27.83 OUTPUT_DEC.15
O1
  Top 0.356: IC1.2 22.77,8.97 22.77,14.27 21.65,15.39 21.65,17.63 22.49,18.47 23.33,18.47 24.17,19.3 24.17,26.01 25.29,27.13 25.29,27.83 OUTPUT_DEC.14
O2
  Top 0.356: IC1.13 22.91,16.51 24.87,18.47 25.98,18.47 26.82,19.3 26.82,26.71 27.94,27.83 OUTPUT_DEC.13
O3  (via drill 0.61)
  Top 0.356: v97.65,35.93 97.65,10.22 95.14,7.71 89.83,7.71 85.64,3.52 38.56,3.52 34.37,7.71 34.37,9.94 31.85,12.46 31.85,21.26 30.59,22.52 30.59,27.83 OUTPUT_DEC.12
  Bottom 0.356: v97.65,35.93 94.86,35.93 94.02,36.77 LED_LATCH.1
O4  (via drill 0.61)
  Top 0.356: v34.23,48.78 v34.23,44.59 | v34.23,64.85 34.23,66.24 33.11,67.36 33.11,71.41 38.84,77.14 38.84,97.68 46.94,105.78 96.11,105.78 104.22,97.68 104.22,90.69 107.71,87.2 107.71,79.38 109.11,77.98 109.11,68.34 v102.96,62.19
  Bottom 0.356: v34.23,44.59 35.48,43.33 35.48,31.32 33.11,28.94 33.11,27.96 OUTPUT_DEC.11 | v34.23,64.85 v34.23,48.78 | v102.96,62.19 99.19,58.42 LED_LATCH1.1
RD*
  Top 0.356: 8085-MPU.32 73.76,86.36 73.76,92.65 P31-40.2
  Bottom 0.356: MEM-DEC.2 107.85,95.16 102.68,89.99 94.72,89.99 93.6,88.88 76.28,88.88 73.76,86.36 8085-MPU.32
READY
  Top 0.356: 8085-MPU.35 81.31,86.36 81.31,92.65 P31-40.5
  Bottom 0.356: R2.2 41.91,98.93 44.15,98.93 47.22,95.86 78.23,95.86 81.31,92.79 P31-40.5
RES_IN
  Top 0.356: P31-40.6 8085-MPU.36
  Bottom 0.356: 128.27,73.66 128.27,68.58 127,67.31 C29.1 C8.+ | 128.27,73.66 R9.2 | 128.27,73.66 128.27,77.47 127.28,78.46 RESET.2 121.26,78.54 114.28,85.52 103.66,85.52 100.86,88.32 85.78,88.32 8085-MPU.36
RES_OUT
  Top 0.356: 8085-MPU.3 88.99,70.99 88.99,66.1 P1-10.3
RST5_5
  Top 0.356: P1-10.9 73.76,66.1 73.76,70.99 8085-MPU.9 73.62,71.27 73.62,77.28 67.33,83.57 67.33,94.04 64.82,96.56 64.82,98.93 R5.2
RST6_5
  Top 0.356: R6.2 53.23,99.07 53.23,101.31 52.11,102.43 52.11,103.26 52.95,104.1 61.33,104.1 69.85,95.58 69.85,81.89 76.14,75.6 76.14,71.13 8085-MPU.8 76.28,70.99 76.28,66.1 P1-10.8
RST7_5
  Top 0.356: P1-10.7 78.79,66.1 78.79,70.99 8085-MPU.7 78.65,71.27 78.65,73.93 72.36,80.21 72.36,94.04 64.82,101.59 64.82,102.85 R7.2
S0
  Top 0.356: 8085-MPU.29 66.08,86.36 66.08,92.65 P21-30.9
S1
  Top 0.356: 8085-MPU.33 76.28,86.36 76.28,92.65 P31-40.3
SCK
  Top 0.356: Q1.3 15.37,36.91 17.74,39.28 R42.1 17.88,39.42 20.26,41.8 31.71,41.8 ADDRESSABLE_LATCH.5
SCK_LOW
  Top 0.356: R34.1 17.74,36.77 17.18,36.77 15.93,35.51 13.97,35.51 12.71,36.77 Q1.1 12.57,36.91 7.68,41.8 3.91,41.8 JP1.3
SID  (via drill 0.61)
  Top 0.356: P1-10.5 8085-MPU.5 83.82,71.27 73.48,81.61 v73.48,83.71 | v104.22,86.64 102.68,86.64 v94.86,78.82
  Bottom 0.356: C31.1 116.84,85.09 C9.+ 115.57,87.63 114.3,88.9 110.21,88.9 SID.2 109.8,88.6 106.17,88.6 v104.22,86.64 | v73.48,83.71 71.39,83.71 69.85,85.24 69.85,94.04 68.59,95.3 41.21,95.3 33.67,87.76 29.34,87.76 R10.2 | v94.86,78.82 91.64,78.82 83.82,70.99 8085-MPU.5
SOD
  Top 0.356: P1-10.4 86.33,66.1 86.33,70.99 8085-MPU.4 86.33,71.27 87.59,72.53 87.59,94.04 88.85,95.3 88.85,101.59 R15.2
SS
  Top 0.356: R46.1 8.94,20.42 15.23,26.71 Q3.3
  Bottom 0.356: ADDRESSABLE_LATCH.4 31.85,44.45 31.85,44.17 33.67,42.35 33.67,38.86 32.83,38.02 28.22,38.02 20.12,29.92 18.58,29.92 15.37,26.71 Q3.3
SS_LOW
  Top 0.356: 12.57,29.08 16.48,32.99 17.74,32.99 R45.1 | 12.57,29.08 12.57,26.71 Q3.1 | 12.57,29.08 8.8,29.08 1.54,36.35 1.54,55.21 3.35,57.02 3.77,57.02 JP1.9
TRAP
  Top 0.356: 8085-MPU.6 81.31,70.99 81.31,66.1 P1-10.6
  Bottom 0.356: R8.2 99.05,67.36 96.11,67.36 94.3,69.18 83.12,69.18 81.31,70.99 8085-MPU.6
VCC  (via drill 0.61)
  Top 0.61: 15.24,77.47 15.24,83.82 13.97,85.09 C16.1 11.43,85.09 7.58,88.94 USB.VBUS | 15.24,77.47 13.97,76.2 C17.+ 11.18,76.3 10.06,77.42 5.31,77.42 PWR5.1 5.31,77.14 2.93,74.77 2.93,70.71 IC10.3 2.78,68.34 3.81,67.31 13.97,67.31 C3.1 | MISO_LATCH.20 86.33,8.97 78.65,8.97 77.53,10.08 C26.1 77.25,10.36 77.25,11.06 76.14,12.18 76.14,17.77 77.39,19.02 C19.1 | v83.82,34.25 86.33,36.77 LED_LATCH.20 | R42.2 25.29,39.28 25.29,38.58 20.4,33.69 20.4,27.96 OUTPUT_DEC.16 | RAM-62256P.28 46.94,38.02 46.94,36.63 44.15,33.83 44.15,14.83 43.31,14 39.4,14 C5.1 | P31-40.10 94.02,92.65 94.02,86.36 8085-MPU.40 | MEM-DEC.16 105.47,102.85 108.13,100.19 113.16,100.19 118.05,95.3 MEM-DEC.6 118.19,95.02 118.19,89.57 124.33,83.43 124.33,81.33 R9.1 124.61,81.05 126.99,78.68 126.99,56.6 125.73,55.35 C2.1 | v91.64,45.15 91.64,45.57 89.41,47.8 89.41,58.98 88.71,59.68 86.47,59.68 LED_LATCH.11 | R14.1 24.17,91.53 27.94,91.53 R48.2 28.08,91.81 30.39,94.11 | 30.39,94.11 34.23,97.96 34.23,98.93 R2.1 | 39.4,73.65 43.17,69.88 43.17,59.82 C18.1 | 39.4,73.65 38.14,73.65 C27.1 | 15.24,77.47 15.51,77.42 17.88,77.42 19,76.3 NOT_GATE.14 | 30.39,94.11 36.74,87.76 R10.1 | C20.1 41.91,84.4 39.53,82.03 39.53,73.93 39.4,73.65
  Bottom 0.61: C1.1 87.63,5.08 86.36,6.35 MISO_LATCH.20 | C19.1 75.63,20.89 74.42,20.89 73.63,21.68 73.63,24.11 73.44,24.29 | 73.44,24.29 64.71,33.02 49.53,33.02 49.53,35.56 RAM-62256P.28 | C6.1 39.4,25.4 | 39.4,25.4 21.59,25.4 | 21.59,25.4 21.59,26.67 OUTPUT_DEC.16 | C5.1 38.1,13.97 36.83,12.7 22.86,12.7 20.32,15.24 IC1.14 20.26,16.79 20.26,17.77 19,19.02 19,25.17 | C18.1 45.72,59.69 ROM-58C256.28 ROM-58C256.27 49.59,58.14 51.41,56.32 52.53,56.32 53.37,57.16 53.37,59.68 56.16,62.47 71.94,62.47 73.2,61.21 86.19,61.21 86.36,60.96 | C27.1 38.1,77.47 36.83,78.74 | 36.83,78.74 20.32,78.74 19.05,77.47 NOT_GATE.14 | C2.1 LED_LATCH1.11 | C11.1 87.63,62.23 86.36,60.96 | 86.36,60.96 LED_LATCH.11 | MEM-DEC.16 104.14,101.6 100.33,101.6 C25.1 99.05,100.19 94.02,95.16 94.02,92.79 P31-40.10 | 36.83,45.71 C14.1 37.02,31.6 39.4,29.22 39.4,25.4 | 36.83,45.71 36.83,52.07 ADDRESSABLE_LATCH.16 39.4,51.85 39.4,49.62 ADDRESSABLE_LATCH.15 | C20.1 44.45,82.55 92.71,82.55 92.71,83.82 93.98,85.09 8085-MPU.40 | v83.82,34.25 83.4,34.25 73.44,24.29 | 36.83,45.71 30.45,45.71 27.94,43.19 25.43,43.19 R44.2 25.29,43.47 25.29,56.05 15.37,65.96 C3.1 | 19,25.17 21.51,25.17 21.59,25.4 | 19,25.17 12.01,25.17 9.36,27.83 8.94,27.83 R46.2 | JP2.9 102.82,45.85 102.82,46.27 99.19,49.9 99.19,50.74 LED_LATCH1.20 99.19,49.48 95.42,45.71 92.2,45.71 v91.64,45.15 | R10.1 36.88,87.62 36.88,78.96 36.83,78.74 | C26.1 73.66,10.16 ADDLATCH.20
WR*
  Top 0.356: 8085-MPU.31 71.11,86.36 71.11,92.65 P31-40.1
  Bottom 0.356: MEM-DEC.1 105.33,95.16 99.05,95.16 93.88,89.99 73.76,89.99 71.11,92.65 P31-40.1
WRITE_SPI
  Top 0.356: IC1.12 25.43,16.51 27.38,18.47 28.5,18.47 29.34,19.3 29.34,29.5 37.44,37.6 37.44,45.15 39.26,46.96 ADDRESSABLE_LATCH.14
X1
  Top 0.356: P1-10.1 94.02,66.1 94.02,70.99 8085-MPU.1
  Bottom 0.356: CRYSTAL.2 101.6,72.39 101.6,71.12 8085-MPU.1
X2
  Top 0.356: P1-10.2 91.5,66.1 91.5,70.99 8085-MPU.2
  Bottom 0.356: 8085-MPU.2 93.28,72.96 94.44,72.96 95.09,72.31 95.09,71.84 95.25,71.68 100.33,71.68 100.33,72.69 102.41,74.77 102.71,74.77 102.87,74.93 CRYSTAL.1 104.14,78.74 C7.1

### Text on the board
tNames: COMPASS | 157EC15 | 172EC15
tValues: ATTACH LED MODULE